# Altium schematic sheet SIM_ThayThe.SchDoc
size A
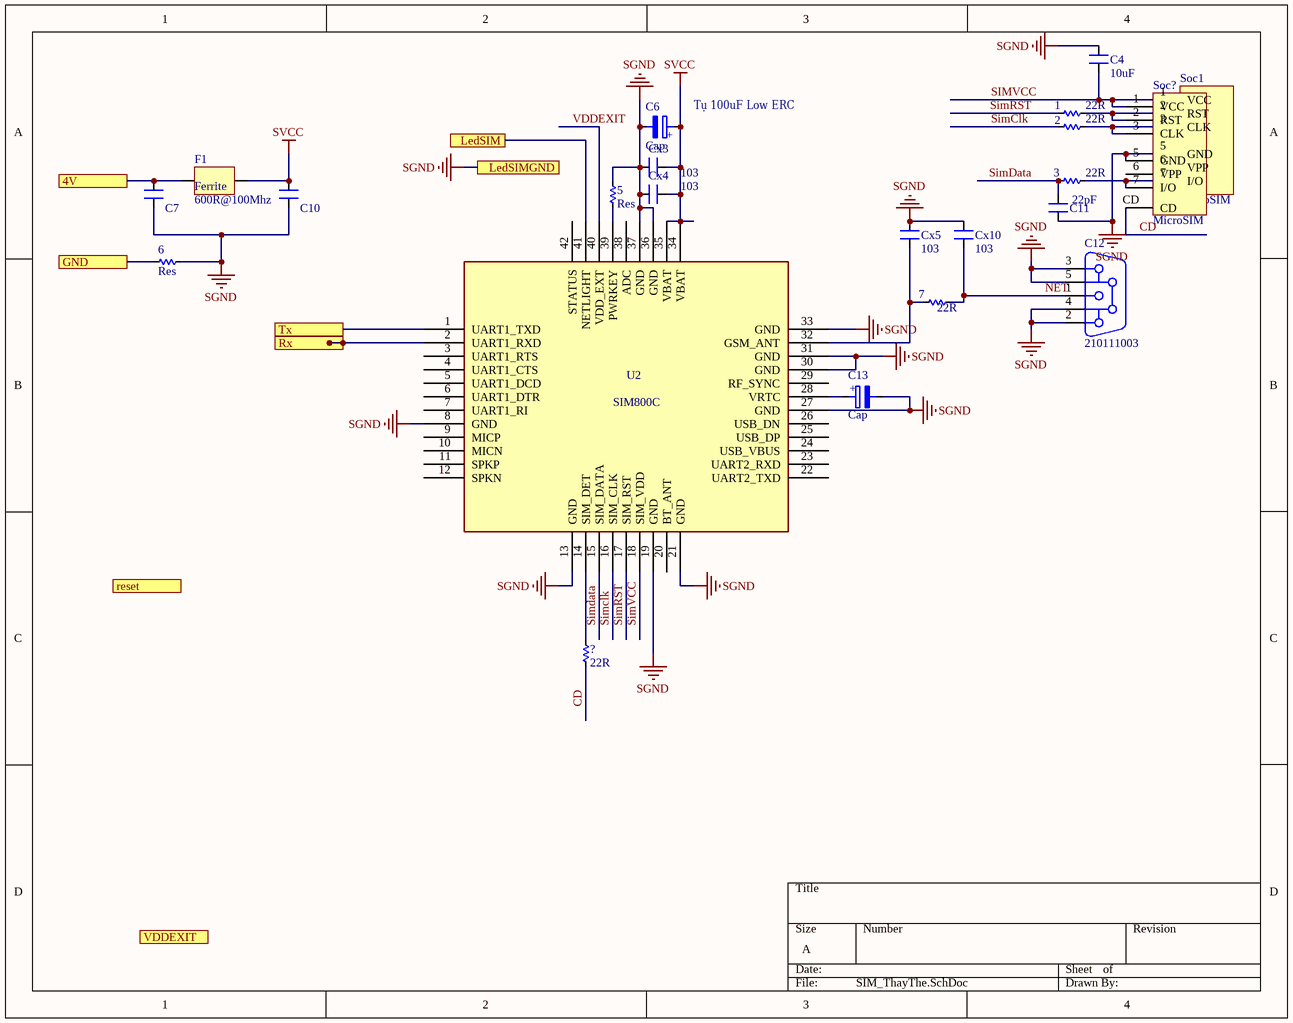
[diagram p0: SIM_ThayThe.SchDoc]

## Parts
1  22R  [RES-SMD-0603]
2  22R  [RES-SMD-0603]
3  22R  [RES-SMD-0603]
5  Res  [RES-SMD-1206]
6  Res  [RES-SMD-0805]
7  22R  [RES-SMD-0603]
?  22R  [RES-SMD-0603]
C4  10uF  [CN-SMD-0805]
C6  Cap  [Cap_C]
C7  CN  [CN-SMD-0805]  (value not drawn)
C10  CN  [CN-SMD-0805]  (value not drawn)
C11  22pF  [CN-SMD-0805]
C12  210111003  [SMA-RA]
C13  Cap  [Cap_C]
Cx3  103  [CN-SMD-1206]
Cx4  103  [CN-SMD-1206]
Cx5  103  [CN-SMD-1206]
Cx10  103  [CN-SMD-1206]
F1  600R@100Mhz  [Capacitor_805]
Soc1  MicroSIM  [microSIM]
Soc?  MicroSIM  [nanoSIM]
U2  SIM800C  [SIM800C]

## Ports
4V, GND, LedSIM, LedSIMGND, reset, Rx, Tx, VDDEXIT

## Nets
SGND: 5.1 6.2 C4.2 C6.2 C7.1 C10.1 C11.1 C12.2 C12.3 C12.4 C12.5 C13.2 Cx3.2 Cx4.2 Cx5.2 Cx10.2 Soc1.5(GND) Soc?.5(GND) U2.8(GND) U2.13(GND) U2.19(GND) U2.21(GND) U2.27(GND) U2.30(GND) U2.31(GND) U2.33(GND) U2.36(GND) U2.37(GND) ; port LedSIMGND
SVCC: C6.1 C10.2 Cx3.1 Cx4.1 F1.2 U2.34(VBAT) U2.35(VBAT)
4V: C7.2 F1.1 ; port 4V
CD: ?.1 Soc?.CD
GND: 6.1 ; port GND
LedSIM: U2.41(NETLIGHT) ; port LedSIM
NET: 7.2 C12.1 Cx10.1
Rx: U2.2(UART1_RXD) ; port Rx
SimClk: 2.1 U2.16(SIM_CLK)
SimData: 3.1 C11.2 U2.15(SIM_DATA)
SimRST: 1.1 U2.17(SIM_RST)
SIMVCC: C4.1 Soc1.1(VCC) Soc?.1(VCC) U2.18(SIM_VDD)
Tx: U2.1(UART1_TXD) ; port Tx
VDDEXIT: U2.40(VDD_EXT)
Net1_2: 1.2 Soc1.2(RST) Soc?.2(RST)
Net2_2: 2.2 Soc1.3(CLK) Soc?.3(CLK)
Net3_2: 3.2 Soc1.7(I/O) Soc?.7(I/O)
Net5_2: 5.2 U2.39(PWRKEY)
Net7_1: 7.1 Cx5.1 U2.32(GSM_ANT)
Net?_2: ?.2 U2.14(SIM_DET)
NetC13_1: C13.1 U2.28(VRTC)

Not connected (* = marked no-connect by the designer): Soc1 6(VPP); Soc? 6(VPP); U2 3(UART1_RTS) 4(UART1_CTS) 5(UART1_DCD) 6(UART1_DTR) 7(UART1_RI) 9(MICP) 10(MICN) 11(SPKP) 12(SPKN) 20(BT_ANT) 22(UART2_TXD) 23(UART2_RXD) 24(USB_VBUS) 25(USB_DP) 26(USB_DN) 29(RF_SYNC) 38(ADC) 42(STATUS)

## Notes on the sheet
- (near C6) Tụ 100uF Low ERC
- (in symbol Cap_tan) +

## Library data of the parts
1-3 5-7 ? = Res-SMD: Resistor; Manufacturer: Generic Components; Class: Passive; Published: 08/06/2000; Publisher: Altium Hobart Technology Centre
C4 C7 C10 C11 Cx3-Cx5 Cx10 = CN: Value: 33pF
C6 C13 = Cap_tan: Polarized Capacitor (Radial)
C12 = CON Ant: CONNECTOR ANTEN; Manufacturer: Würth Elektronik eiSos GmbH; partNo: 210111003; ComponentLink1Description: Manufacturer; ComponentLink1URL: http://www.we-online.de; Created by: Christin Zierenner; Created Date: May 2012; ComponentLink2Description: Datasheet; ComponentLink2URL: http://katalog.we-online.de/kataloge/eisos/index.php?language=en&pf=Filter_gerade
F1 = Ferrite
Soc1 = Soc_Micro_SIM
Soc? = SIM_Micro_SIM